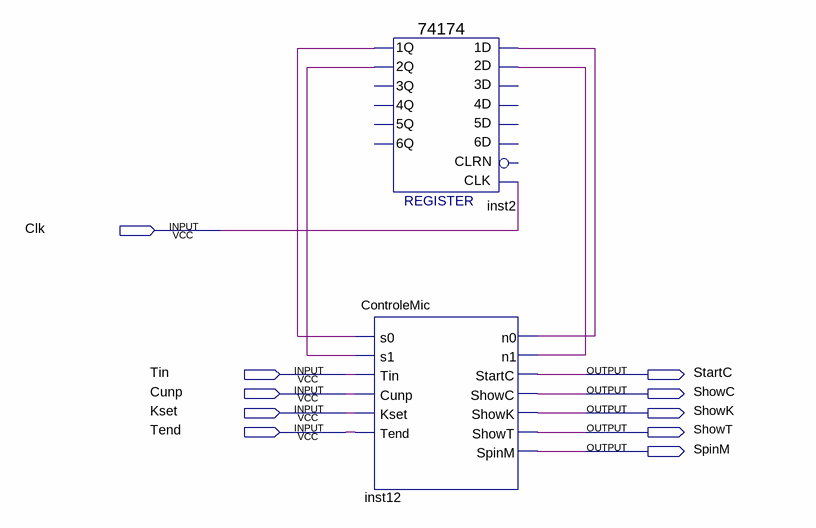
[diagram p0: schematic sheet]
// Quartus schematic ControleMic2.bdf as structural Verilog: 2 symbols, 10 pins
module ControleMic2 (
  input  Clk,
  input  Tin,
  input  Cunp,
  input  Kset,
  input  Tend,
  output StartC,
  output ShowC,
  output ShowK,
  output ShowT,
  output SpinM
);

  wire inst2_1q, inst2_2q, inst12_n0, inst12_n1;

  \74174  inst2 (
    .CLK(Clk), .\1D (inst12_n0), .\2D (inst12_n1), .\1Q (inst2_1q), .\2Q (inst2_2q));  // open: 4D, 3D, 5D, 6D, CLRN, 4Q, 3Q, 6Q, 5Q
  ControleMic inst12 (
    .s0(inst2_1q), .s1(inst2_2q), .Tin(Tin), .Cunp(Cunp), .Kset(Kset), .Tend(Tend), .n0(inst12_n0),
    .n1(inst12_n1), .StartC(StartC), .ShowC(ShowC), .ShowK(ShowK), .ShowT(ShowT), .SpinM(SpinM));
endmodule
